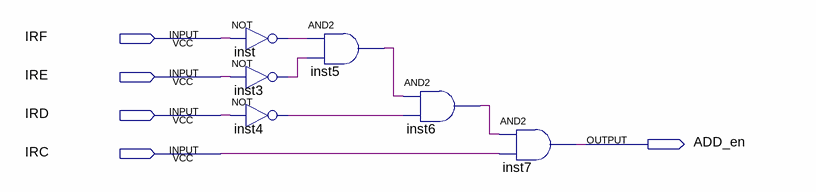
[diagram p0: schematic sheet]
// Quartus schematic ADD_EN.bdf as structural Verilog: 6 symbols, 5 pins
module ADD_EN (
  input  IRF,
  input  IRE,
  input  IRD,
  input  IRC,
  output ADD_en
);

  wire inst3_out, inst4_out, inst5_out, inst6_out, inst_out;

  not inst (inst_out, IRF);
  not inst3 (inst3_out, IRE);
  not inst4 (inst4_out, IRD);
  and inst5 (inst5_out, inst_out, inst3_out);
  and inst6 (inst6_out, inst5_out, inst4_out);
  and inst7 (ADD_en, inst6_out, IRC);
endmodule
